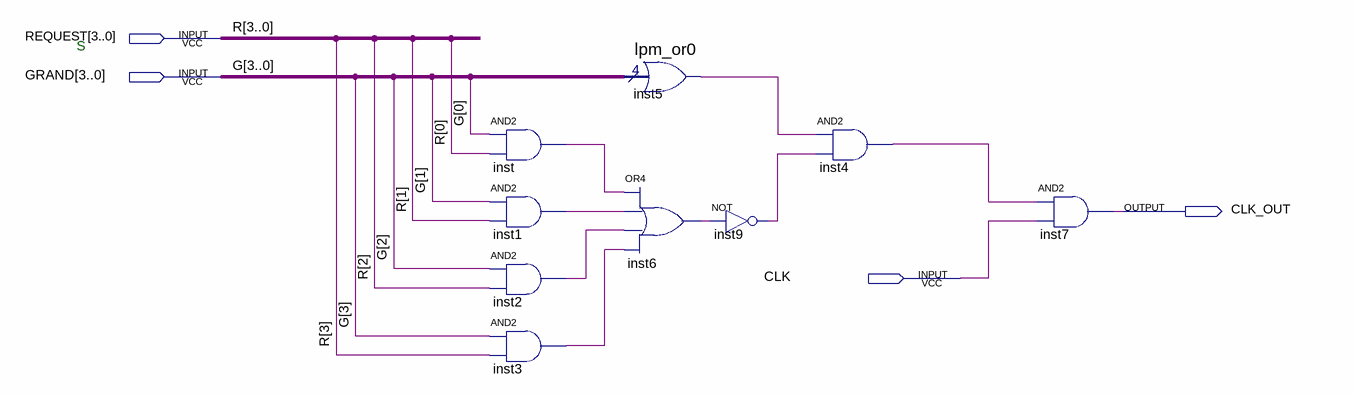
[diagram p0: schematic sheet]
// Quartus schematic ArbitrationTactLogic.bdf as structural Verilog: 9 symbols, 4 pins
module ArbitrationTactLogic (
  input  [3:0] REQUEST,
  input  [3:0] GRAND,
  input  CLK,
  output CLK_OUT
);

  wire inst1_out, inst2_out, inst3_out, inst4_out, inst5_result, inst6_out, inst9_out, inst_out;

  and inst (inst_out, GRAND[0], REQUEST[0]);
  and inst1 (inst1_out, GRAND[1], REQUEST[1]);
  and inst2 (inst2_out, GRAND[2], REQUEST[2]);
  and inst3 (inst3_out, GRAND[3], REQUEST[3]);
  lpm_or0 inst5 (.data(GRAND), .result(inst5_result));
  or inst6 (inst6_out, inst_out, inst1_out, inst2_out, inst3_out);
  not inst9 (inst9_out, inst6_out);
  and inst4 (inst4_out, inst5_result, inst9_out);
  and inst7 (CLK_OUT, inst4_out, CLK);

  // Other names for the same wires on the sheet: G[3:0] = GRAND; R[3:0] = REQUEST

  // Notes on the sheet:
  //   S
endmodule
